# EAGLE design drv8833 (EAGLE 9.6.2)
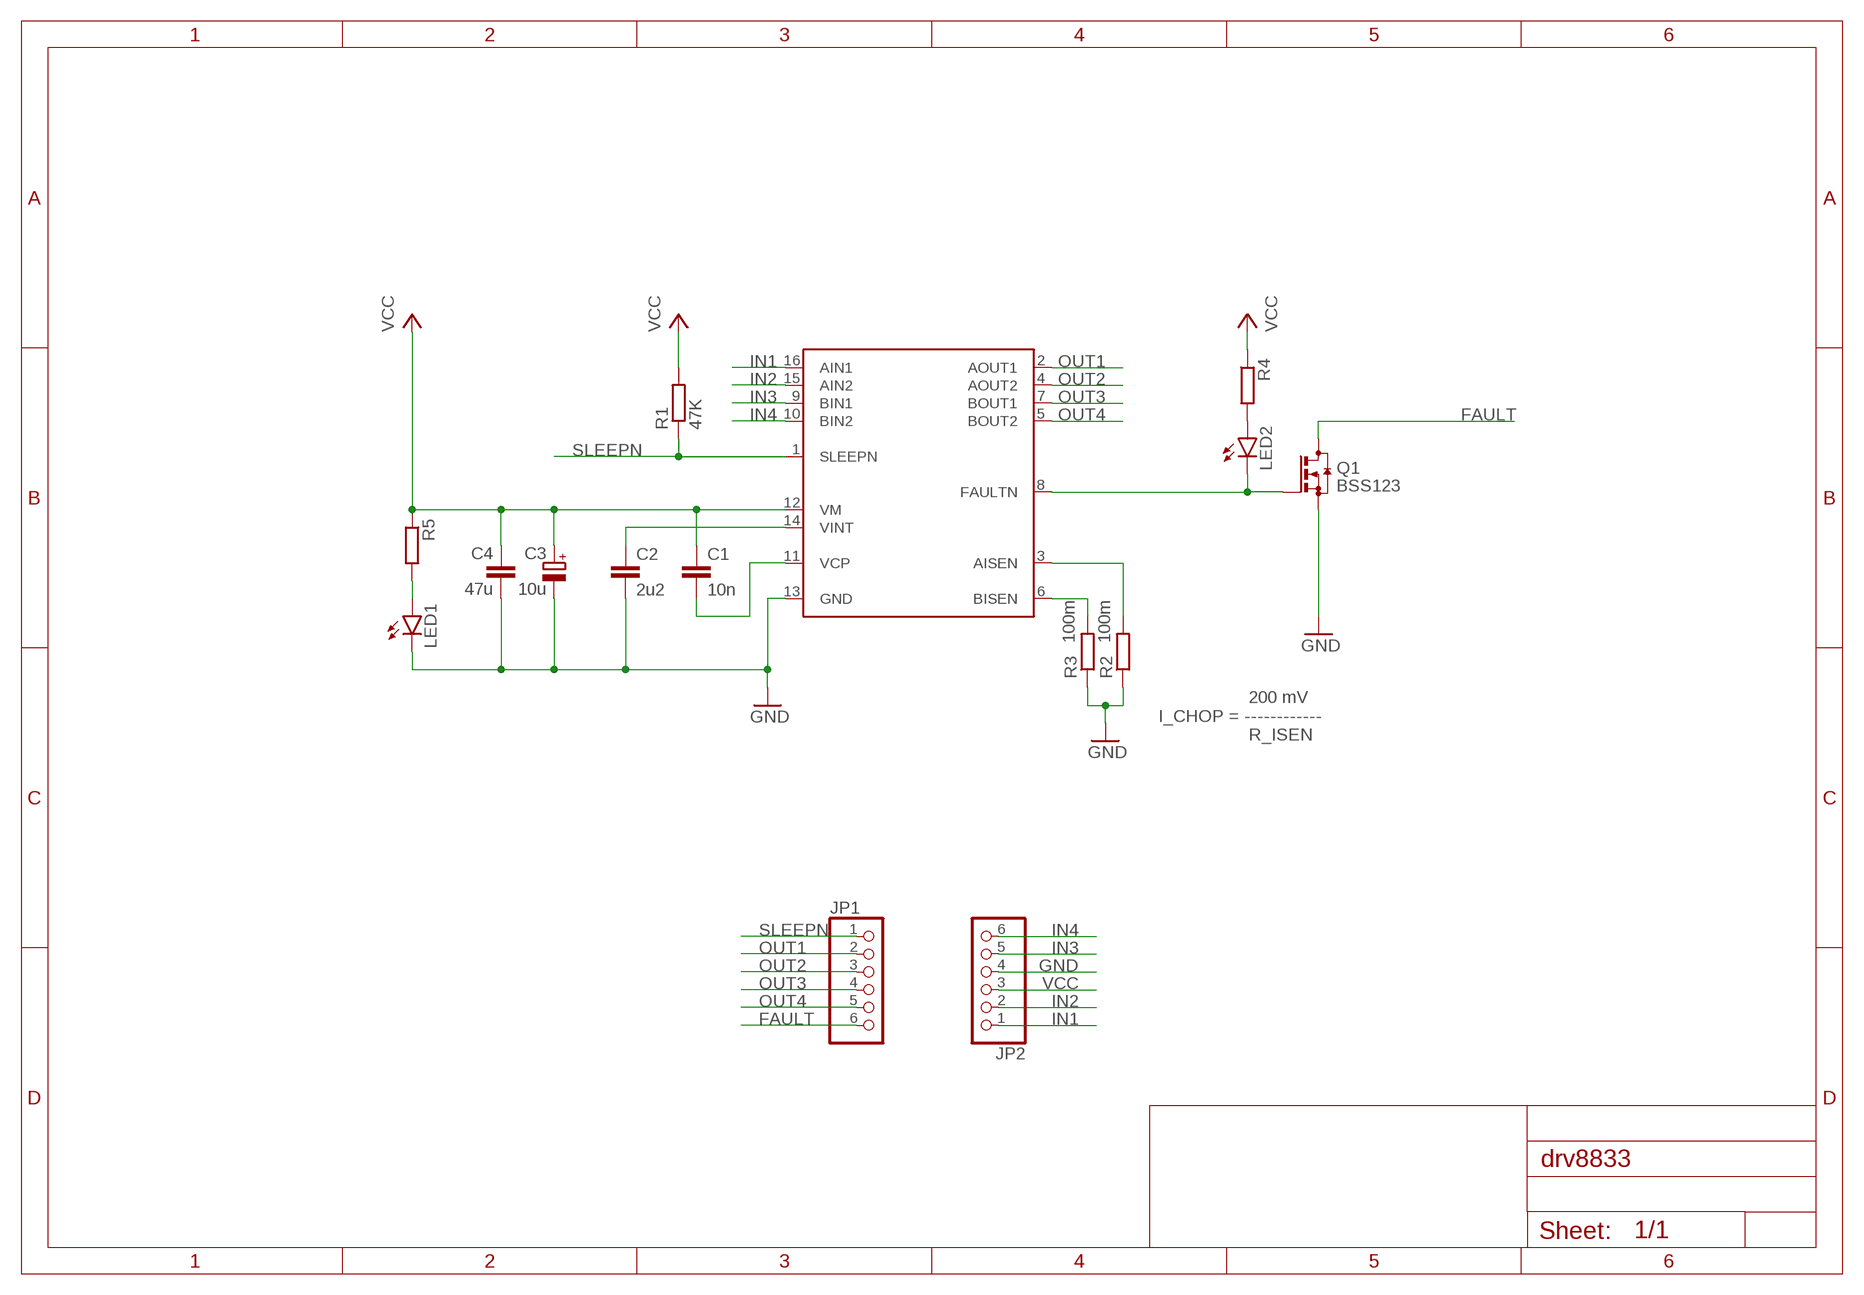
[diagram p0: schematic, sheet 1]

## Parts
C1  10n  C0603  [C0603]
C2  2u2  C0603  [C0603]
C3  10u  CPOL-EUA/3216-18W  [A/3216-18W]
C4  47u  C-EUC1210  [C1210]
JP1  PINHD-1X6  [1X06]
JP2  PINHD-1X6  [1X06]
LED1  LEDCHIPLED_0805  [CHIPLED_0805]
LED2  LEDCHIPLED_0805  [CHIPLED_0805]
Q1  BSS123  [SOT23]
R1  47K  R0603  [R0603]
R2  100m  R-EU_R1206  [R1206]
R3  100m  R-EU_R1206  [R1206]
R4  R0603  [R0603]
R5  R0603  [R0603]
U$1  DRV8833  [TSSOP-16]

## Nets
AISEN: R2.2 U$1.3(AISEN)
BISEN: R3.2 U$1.6(BISEN)
FAULT: JP1.6 Q1.3(D)
FAULTN: LED2.C Q1.1(G) U$1.8(FAULTN)
FLT_AN: LED2.A R4.2
GND: C2.2 C3.- C4.2 JP2.4 LED1.C Q1.2(S) R2.1 R3.1 U$1.13(GND)
IN1: JP2.1 U$1.16(AIN1)
IN2: JP2.2 U$1.15(AIN2)
IN3: JP2.5 U$1.9(BIN1)
IN4: JP2.6 U$1.10(BIN2)
OUT1: JP1.2 U$1.2(AOUT1)
OUT2: JP1.3 U$1.4(AOUT2)
OUT3: JP1.4 U$1.7(BOUT1)
OUT4: JP1.5 U$1.5(BOUT2)
PWR_LED: LED1.A R5.2
SLEEPN: JP1.1 R1.1 U$1.1(SLEEPN)
VCC: C1.1 C3.+ C4.1 JP2.3 R1.2 R4.1 R5.1 U$1.12(VM)
VCP: C1.2 U$1.11(VCP)
VINT: C2.1 U$1.14(VINT)

## Notes on the sheet
- 200 mV
  I_CHOP = ------------
                    R_ISEN

## Library data of the parts
C1 C2 = drv8833:C
C3 = rcl:CPOL-EU: POLARIZED CAPACITOR, European symbol; SPICEPREFIX: C
C4 = rcl:C-EU: CAPACITOR, European symbol; SPICEPREFIX: C
JP1 JP2 = drv8833:PINHD-1X6: PIN HEADER
LED1 LED2 = led:LED: LED OSRAM: - CHIPLED LG R971, LG N971, LY N971, LG Q971, LY Q971, LO R971, LY R971 LH N974, LH R974 LS Q976, LO Q976, LY Q976 LO Q996 - Hyper CHIPLED LW Q18S LB Q993, LB Q99A, LB R99A - SideLED LS A670, LO A670, LY A670, LG A670, LP A670 LB A673, LV A673, LT A673, LW A673 LH A674 LY A675 LS A676, LA A676, LO A676, LY A676, LW A676 LS A679, LY A679, LG A679 - Hyper Micro SIDELED® LS Y876, LA Y876, LO Y876, LY Y876 LT Y87S - SmartLED LW L88C, LW L88S LB L89C, LB L89S, LG L890 LS L89K, LO L89K, LY L89K LS L896, LA L896, LO L896, LY L896 - TOPLED LS T670, LO T670, LY T670, LG T670, LP T670 LSG T670, LSP T670, LSY T670, LOP T670, LYG T670 LG T671, LOG T671, LSG T671 LB T673, LV T673, LT T673, LW T673 LH T674 LS T676, LA T676, LO T676, LY T676, LB T676, LH T676, LSB T676, LW T676 LB T67C, LV T67C, LT T67C, LS T67K, LO T67K, LY T67K, LW E67C LS E67B, LA E67B, LO E67B, LY E67B, LB E67C, LV E67C, LT E67C LW T67C LS T679, LY T679, LG T679 LS T770, LO T770, LY T770, LG T770, LP T770 LB T773, LV T773, LT T773, LW T773 LH T774 LS E675, LA E675, LY E675, LS T675 LS T776, LA T776, LO T776, LY T776, LB T776 LHGB T686 LT T68C, LB T68C - Hyper Mini TOPLED® LB M676 - Mini TOPLED Santana® LG M470 LS M47K, LO M47K, LY M47K Source: http://www.osram.convergy.de LUXEON: - LUMILED® LXK2-PW12-R00, LXK2-PW12-S00, LXK2-PW14-U00, LXK2-PW14-V00 LXK2-PM12-R00, LXK2-PM12-S00, LXK2-PM14-U00 LXK2-PE12-Q00, LXK2-PE12-R00, LXK2-PE12-S00, LXK2-PE14-T00, LXK2-PE14-U00 LXK2-PB12-K00, LXK2-PB12-L00, LXK2-PB12-M00, LXK2-PB14-N00, LXK2-PB14-P00, LXK2-PB14-Q00 LXK2-PR12-L00, LXK2-PR12-M00, LXK2-PR14-Q00, LXK2-PR14-R00 LXK2-PD12-Q00, LXK2-PD12-R00, LXK2-PD12-S00 LXK2-PH12-R00, LXK2-PH12-S00 LXK2-PL12-P00, LXK2-PL12-Q00, LXK2-PL12-R00 Source: www.luxeon.com KINGBRIGHT: KA-3528ASYC Source: www.kingbright.com
Q1 = transistor-small-signal:BSS123: N-CHANNEL MOS FET
R1 R4 R5 = drv8833:R
R2 R3 = rcl:R-EU_: RESISTOR, European symbol; SPICEPREFIX: R
U$1 = drv8833:DRV8833

## Board
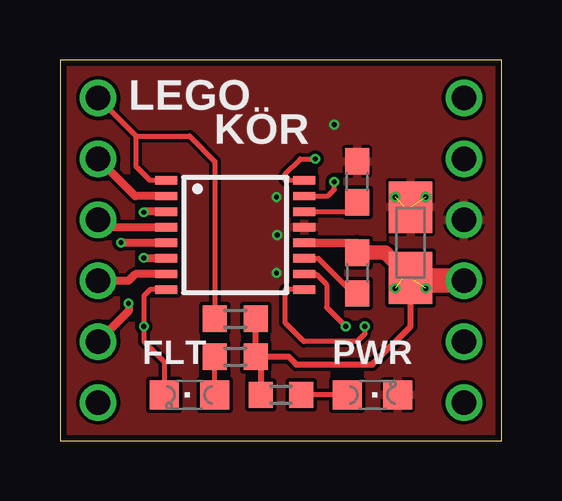
[diagram p1: board, top side]
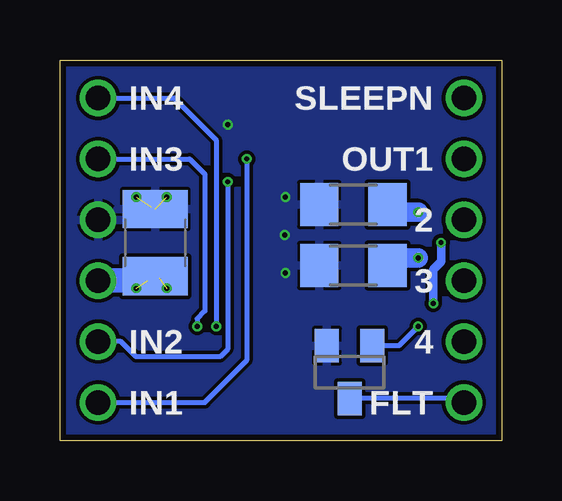
[diagram p2: board, bottom side, seen from below]

Size 18.41 x 15.88 mm. Coordinates in mm from the lower left corner, seen from the top.
Outline: 0,15.88 0,0 18.42,0 18.42,15.88 0,15.88
Copper layers (1*16): Top 0.035mm / dielectric 1.5mm / Bottom 0.035mm
Design rules "default *": minimum track width 6mil, minimum drill 0.2mm, track to track 6mil, track to pad 6mil, pad to pad 6mil, via to via 6mil, smd to smd 6mil, copper to edge 10mil, drill to drill 6mil, minimum pad ring 0.1mm, minimum via ring 0.1mm, stop-mask expansion 4mil, vias tented up to drill 0mil, thermal gap 5mil

### Footprints (pad centres in the part's own frame; a part is rotated, then mirrored left to right if it is on the bottom)
C0603 = smd 1.1 x 1: 1 -0.85,0; 2 0.85,0
A/3216-18W = smd 2.15 x 1.8: + 1.475,0; - -1.475,0
C1210 = smd 1.6 x 2.7: 1 -1.4,0; 2 1.4,0
1X06 = drill 1.016: 1 -6.35,0; 2 -3.81,0; 3 -1.27,0; 4 1.27,0; 5 3.81,0; 6 6.35,0
CHIPLED_0805 = smd 1.2 x 1.2: A 0,-1.05; C 0,1.05
SOT23 = smd 1 x 1.4: 1 -0.95,-1.1; 2 0.95,-1.1; 3 0,1.1
R0603 = smd 1 x 1.1: 1 -0.85,0; 2 0.85,0
R1206 = smd 1.6 x 1.803: 1 -1.422,0; 2 1.422,0
TSSOP-16 = smd 0.9 x 0.35: 1 -2.875,2.275; 2 -2.875,1.625; 3 -2.875,0.975; 4 -2.875,0.325; 5 -2.875,-0.325; 6 -2.875,-0.975; 7 -2.875,-1.625; 8 -2.875,-2.275; 9 2.875,-2.275; 10 2.875,-1.625; 11 2.875,-0.975; 12 2.875,-0.325; 13 2.875,0.325; 14 2.875,0.975; 15 2.875,1.625; 16 2.875,2.275

### Placement (x,y rotation side)
C1  12.38,6.99 270 top
C2  12.38,10.8 90 top
C3  14.6,8.25 270 top
C4  14.45,8.25 90 bottom
JP1  1.59,7.94 270 bottom
JP2  16.83,7.94 90 bottom
LED1  13.02,1.91 270 top
LED2  5.4,1.91 90 top
Q1  6.35,2.86 180 bottom
R1  7.3,5.08 0 top
R2  6.19,9.84 0 bottom
R3  6.19,7.3 0 bottom
R4  7.3,3.49 180 top
R5  9.21,1.91 0 top
U$1  7.3,8.57 0 top

### Tracks (layer width: path | path; a pad name or v marks a point on that pad's centre or on a via)
AISEN  (via drill 0.2 pad 0.41)
  Top 0.33: U$1.3 3.52,9.55
  Top 0.356: 3.52,9.55 v3.49,9.52
  Bottom 0.813: v3.49,9.52 4.77,9.52 R2.2
BISEN  (via drill 0.2 pad 0.41)
  Top 0.33: U$1.6 3.52,7.6
  Top 0.356: 3.52,7.6 v3.49,7.62
  Bottom 0.813: v3.49,7.62 4.45,7.62 R3.2
FAULT
  Bottom 0.203: JP1.6 1.76,1.76 Q1.3
FAULTN  (via drill 0.2)
  Top 0.203: U$1.8 3.76,6.3 3.49,6.03 v3.49,4.76 3.49,4.13 4.35,3.27 LED2.C
  Bottom 0.203: Q1.1 4.3,3.96 v3.49,4.76
FLT_AN
  Top 0.203: LED2.A R4.2
GND  (via drill 0.2 pad 0.41)  (2 unrouted)
  other vias: 9.05,8.57 9.02,10.16 9.02,6.99 13.97,10.16 11.43,13.18 15.24,10.16
  pour Bottom (isolate 0.127): -2.54,20 -2.54,-6.67 23.18,-6.67 23.18,20
  pour Top (isolate 0.127): -1.27,18.41 -1.27,-4.13 22.23,-4.13 22.23,18.41
IN1  (via drill 0.2 pad 0.41)
  Top 0.203: U$1.16 9.37,10.85 9.37,11.11 10,11.75 v10.64,11.75
  Bottom 0.203: v10.64,11.75 10.64,3.33 12.38,1.59 JP2.1
IN2  (via drill 0.2 pad 0.41)
  Top 0.203: U$1.15 11.15,10.2 11.43,10.48 v11.43,10.8
  Bottom 0.203: JP2.2 15.87,4.13 15.24,3.49 11.75,3.49 11.43,3.81 v11.43,10.8
IN3  (via drill 0.2 pad 0.41)
  Top 0.203: U$1.9 9.37,6.3 9.37,4.92 10.16,4.13 12.38,4.13 12.7,4.45 v12.7,4.76
  Bottom 0.203: v12.7,4.76 12.7,5.08 12.38,5.4 12.38,11.11 13.02,11.75 JP2.5
IN4  (via drill 0.2 pad 0.41)
  Top 0.203: U$1.10 10.67,6.95 11.11,6.51 11.11,5.56 v11.91,4.76
  Bottom 0.203: v11.91,4.76 11.91,12.54 13.65,14.29 JP2.6
OUT1
  Top 0.33: U$1.2 3.14,10.2 JP1.2
OUT2
  Top 0.33: U$1.4 1.9,8.9 JP1.3
OUT3
  Top 0.33: U$1.7 3.14,6.95 2.86,6.67 JP1.4
OUT4  (via drill 0.2 pad 0.41)
  Top 0.33: U$1.5 v2.55,8.25 | v2.86,5.72 2.86,5.4 JP1.5
  Top 0.356: v2.55,8.25 v2.54,8.25
  Bottom 0.356: v2.54,8.25 2.54,7.46 2.86,7.14 v2.86,5.72
PWR_LED
  Top 0.203: LED1.A R5.2
SLEEPN
  Top 0.203: U$1.1 3.76,10.85 3.17,11.43 3.17,12.7 | 3.17,12.7 JP1.1 | 3.17,12.7 5.4,12.7 6.45,11.64 R1.1
VCC  (via drill 0.2 pad 0.41)  (2 unrouted)
  Top 0.203: R4.1 8.36,3.29
  Top 0.254: 8.15,2.11 R5.1 8.36,3.29 | R1.2 R4.1 9.53,3.49 9.84,3.17 13.02,3.17 14.6,4.76 C3.+
  Top 0.356: U$1.12 12.38,8.25 C1.1
  Top 0.508: 12.5,7.62 C1.1
  Top 0.61: 14.29,6.78 C3.+ 13.55,7.83 C1.1
  Top 1.016: 14.76,6.67 14.65,6.78 C3.+ 14.72,6.67 JP2.3
  Bottom 1.016: JP2.3 14.63,6.67 C4.1
  other vias: 13.97,6.35 15.24,6.35
VCP
  Top 0.203: U$1.11 10.76,7.6 12.22,6.14 C1.2
VINT
  Top 0.203: U$1.14 11.99,9.55 C2.1

### Text on the board
tNames: LEGO / KÖR | FLT | PWR
bNames: SLEEPN / OUT1 / 2 / 3 / 4 / FLT | IN4 / IN3 / / / IN2 / IN1